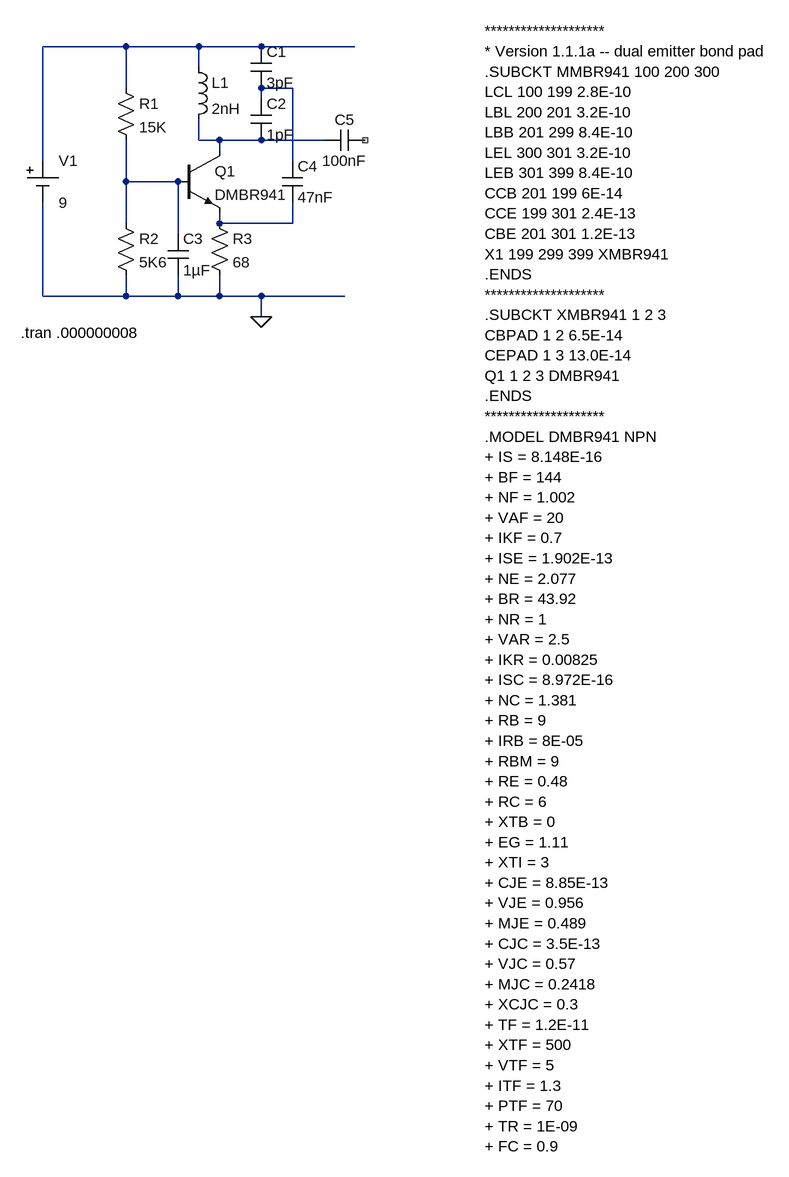
[diagram p0: schematic colpitt.asc]
colpitt.asc, the LTspice schematic file:
Version 4
SHEET 1 1072 1484
WIRE 64 -48 -64 -48
WIRE 176 -48 64 -48
WIRE 272 -48 176 -48
WIRE 416 -48 272 -48
WIRE 176 -16 176 -48
WIRE 64 16 64 -48
WIRE 320 16 272 16
WIRE 272 32 272 16
WIRE 176 96 176 64
WIRE 208 96 176 96
WIRE 272 96 208 96
WIRE 368 96 272 96
WIRE 208 112 208 96
WIRE -64 128 -64 -48
WIRE 320 128 320 16
WIRE 64 160 64 96
WIRE 144 160 64 160
WIRE 64 224 64 160
WIRE 208 224 208 208
WIRE 320 224 320 192
WIRE 320 224 208 224
WIRE 144 240 144 160
WIRE -64 336 -64 192
WIRE 64 336 64 304
WIRE 64 336 -64 336
WIRE 144 336 144 304
WIRE 144 336 64 336
WIRE 208 336 208 304
WIRE 208 336 144 336
WIRE 272 336 208 336
WIRE 400 336 272 336
WIRE 272 368 272 336
FLAG 272 368 0
SYMBOL npn 144 112 R0
SYMATTR InstName Q1
SYMATTR Value DMBR941
SYMBOL ind 160 -32 R0
SYMATTR InstName L1
SYMATTR Value 2nH
SYMBOL cap 256 -48 R0
SYMATTR InstName C1
SYMATTR Value 3pF
SYMBOL cap 256 32 R0
SYMATTR InstName C2
SYMATTR Value 1pF
SYMBOL res 48 0 R0
SYMATTR InstName R1
SYMATTR Value 15K
SYMBOL res 48 208 R0
SYMATTR InstName R2
SYMATTR Value 5K6
SYMBOL cap 128 240 R0
SYMATTR InstName C3
SYMATTR Value 1µF
SYMBOL res 192 208 R0
SYMATTR InstName R3
SYMATTR Value 68
SYMBOL cap 304 128 R0
SYMATTR InstName C4
SYMATTR Value 47nF
SYMBOL cap 368 112 R270
WINDOW 0 32 32 VTop 2
WINDOW 3 0 32 VBottom 2
SYMATTR InstName C5
SYMATTR Value 100nF
SYMBOL Misc\\cell -64 128 R0
WINDOW 123 0 0 Left 2
WINDOW 39 0 0 Left 2
SYMATTR InstName V1
SYMATTR Value 9
TEXT -98 392 Left 2 !.tran .000000008
TEXT 616 -72 Left 2 !********************\n* Version 1.1.1a -- dual emitter bond pad\n.SUBCKT MMBR941 100 200 300 \nLCL 100 199 2.8E-10 \nLBL 200 201 3.2E-10 \nLBB 201 299 8.4E-10 \nLEL 300 301 3.2E-10 \nLEB 301 399 8.4E-10 \nCCB 201 199 6E-14 \nCCE 199 301 2.4E-13 \nCBE 201 301 1.2E-13 \nX1 199 299 399 XMBR941\n.ENDS\n********************\n.SUBCKT XMBR941 1 2 3 \nCBPAD 1 2 6.5E-14 \nCEPAD 1 3 13.0E-14 \nQ1 1 2 3 DMBR941 \n.ENDS\n********************\n.MODEL DMBR941 NPN \n+ IS = 8.148E-16 \n+ BF = 144 \n+ NF = 1.002 \n+ VAF = 20 \n+ IKF = 0.7 \n+ ISE = 1.902E-13 \n+ NE = 2.077 \n+ BR = 43.92 \n+ NR = 1 \n+ VAR = 2.5 \n+ IKR = 0.00825 \n+ ISC = 8.972E-16 \n+ NC = 1.381 \n+ RB = 9 \n+ IRB = 8E-05 \n+ RBM = 9 \n+ RE = 0.48 \n+ RC = 6 \n+ XTB = 0 \n+ EG = 1.11 \n+ XTI = 3 \n+ CJE = 8.85E-13 \n+ VJE = 0.956 \n+ MJE = 0.489 \n+ CJC = 3.5E-13 \n+ VJC = 0.57 \n+ MJC = 0.2418 \n+ XCJC = 0.3 \n+ TF = 1.2E-11 \n+ XTF = 500 \n+ VTF = 5 \n+ ITF = 1.3 \n+ PTF = 70 \n+ TR = 1E-09 \n+ FC = 0.9

The netlist it stands for:
* colpitt.asc
Q1 N003 N004 N005 0 DMBR941
L1 N001 N003 2nH
C1 N001 N002 3pF
C2 N002 N003 1pF
R1 N001 N004 15K
R2 N004 0 5K6
C3 N004 0 1µF
R3 N005 0 68
C4 N002 N005 47nF
C5 N003 NC_01 100nF
V1 N001 0 9
.model NPN NPN
.model PNP PNP
.lib standard.bjt
.tran .000000008
********************
* Version 1.1.1a -- dual emitter bond pad
.SUBCKT MMBR941 100 200 300
LCL 100 199 2.8E-10
LBL 200 201 3.2E-10
LBB 201 299 8.4E-10
LEL 300 301 3.2E-10
LEB 301 399 8.4E-10
CCB 201 199 6E-14
CCE 199 301 2.4E-13
CBE 201 301 1.2E-13
X1 199 299 399 XMBR941
.ENDS
********************
.SUBCKT XMBR941 1 2 3
CBPAD 1 2 6.5E-14
CEPAD 1 3 13.0E-14
Q1 1 2 3 DMBR941
.ENDS
********************
.MODEL DMBR941 NPN
+ IS = 8.148E-16
+ BF = 144
+ NF = 1.002
+ VAF = 20
+ IKF = 0.7
+ ISE = 1.902E-13
+ NE = 2.077
+ BR = 43.92
+ NR = 1
+ VAR = 2.5
+ IKR = 0.00825
+ ISC = 8.972E-16
+ NC = 1.381
+ RB = 9
+ IRB = 8E-05
+ RBM = 9
+ RE = 0.48
+ RC = 6
+ XTB = 0
+ EG = 1.11
+ XTI = 3
+ CJE = 8.85E-13
+ VJE = 0.956
+ MJE = 0.489
+ CJC = 3.5E-13
+ VJC = 0.57
+ MJC = 0.2418
+ XCJC = 0.3
+ TF = 1.2E-11
+ XTF = 500
+ VTF = 5
+ ITF = 1.3
+ PTF = 70
+ TR = 1E-09
+ FC = 0.9
.backanno
.end